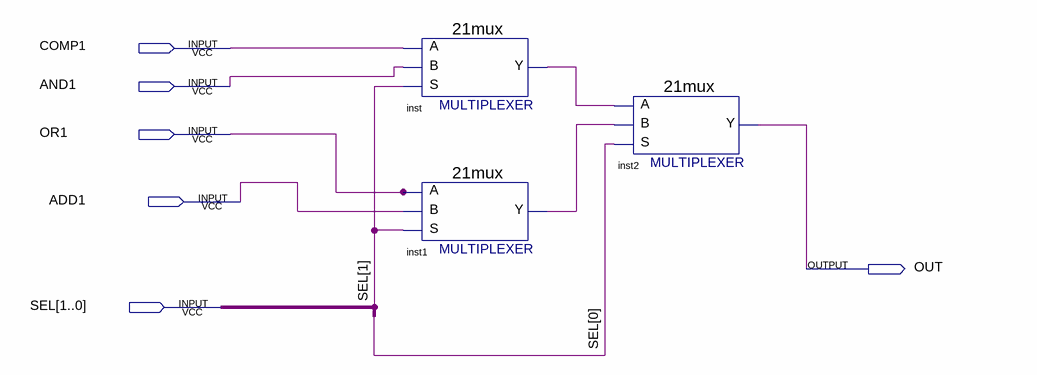
[diagram p0: schematic sheet]
// Quartus schematic 4to1_MUX_PJ2.bdf as structural Verilog: 3 symbols, 6 pins
module \4to1_MUX_PJ2  (
  input  COMP1,
  input  AND1,
  input  OR1,
  input  ADD1,
  input  [1:0] SEL,
  output OUT
);

  wire inst1_y, inst_y;

  \21mux  inst (.S(SEL[1]), .B(AND1), .A(COMP1), .Y(inst_y));
  \21mux  inst1 (.S(SEL[1]), .B(ADD1), .A(OR1), .Y(inst1_y));
  \21mux  inst2 (.S(SEL[0]), .B(inst1_y), .A(inst_y), .Y(OUT));
endmodule
